# Altium schematic sheet MCISO-S05-V00-CANIsolation.SchDoc: Isolated CANBUS @ 3V3
size A3; DrawnBy: Jonn Dillon; DocumentNumber: 4; Revision: 01; SheetNumber: 3; SheetTotal: 9; Version: 01; Project: Battery Managment System 2020; PageSetup: Record=PageOptions|CenterHorizontal=True|CenterVertical=True|PrintScale=0.97|XCorrection=1.00|YCorrection=1.00|PrintKind=0|BorderSize=5000000|LeftOffset=0|BottomOffset=0|Orientation=2|PaperLength=1000|PaperWidth=1000|Scale=100|PaperSource=7|PrintQuality=-4|MediaType=1|DitherType=10|PaperKind=A4|PrintScaleMode=1
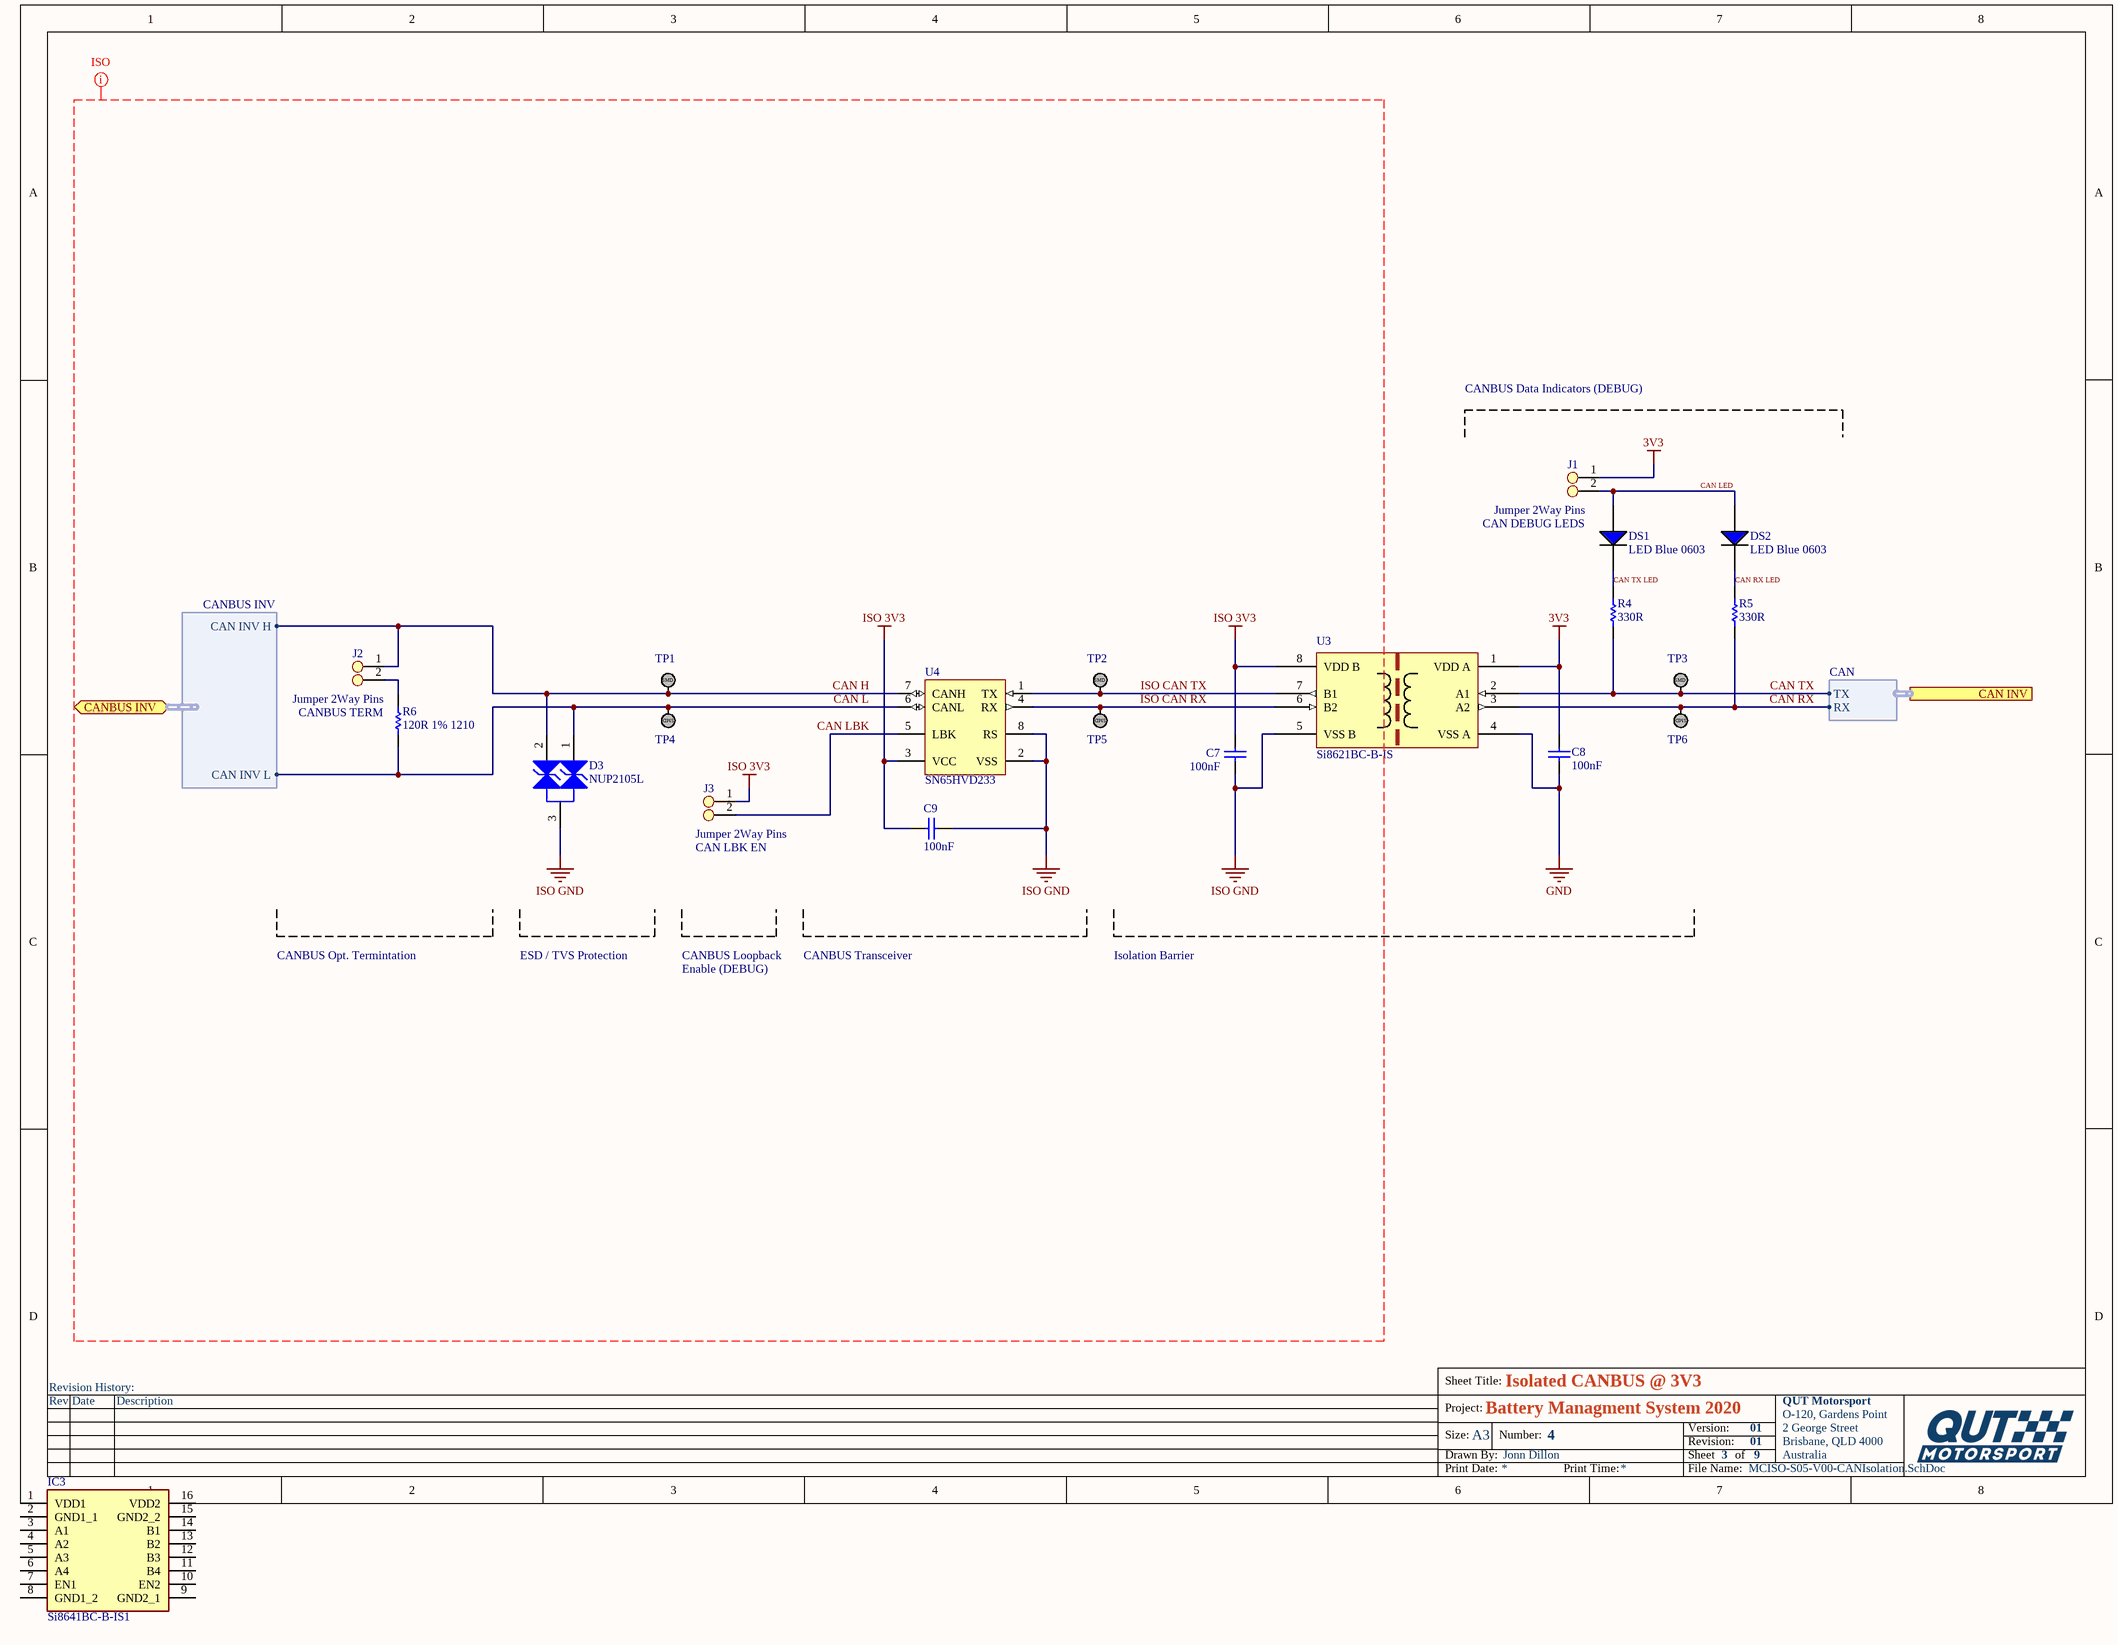
[diagram p0: MCISO-S05-V00-CANIsolation.SchDoc]

## Parts
C7  100nF  [Cap_Ceramic_0603]
C8  100nF  [Cap_Ceramic_0603]
C9  100nF  [Cap_Ceramic_0603]
D3  NUP2105L  [NUP2105L]
DS1  LED Blue 0603  [LED BLUE 0603]
DS2  LED Blue 0603  [LED BLUE 0603]
IC3  Si8641BC-B-IS1  [SOIC127P600X175-16N]
J1  Jumper 2Way Pins  [Jumper_2Way_Pin]
J2  Jumper 2Way Pins  [Jumper_2Way_Pin]
J3  Jumper 2Way Pins  [Jumper_2Way_Pin]
R4  330R  [Res_ThinFilm_0603]
R5  330R  [Res_ThinFilm_0603]
R6  120R 1% 1210  [Res_ThinFilm_1210]
TP1  TestPoint_SMD  [TestPointSMD]  (value not drawn)
TP2  TestPoint_SMD  [TestPointSMD]  (value not drawn)
TP3  TestPoint_SMD  [TestPointSMD]  (value not drawn)
TP4  TestPoint_SMD  [TestPointSMD]  (value not drawn)
TP5  TestPoint_SMD  [TestPointSMD]  (value not drawn)
TP6  TestPoint_SMD  [TestPointSMD]  (value not drawn)
U3  Si8621BC-B-IS  [Si8621BC-B-IS]
U4  SN65HVD233  [SN65HVD233DR]

## Ports
CAN INV (harness CAN), CANBUS INV (bidir, harness CANBUS INV)

## Harnesses
CANBUS INV: CAN INV H, CAN INV L
CAN: RX, TX

## Nets
3V3: C8.2 J1.1 U3.1(VDD_A)
GND: C8.1 U3.4(VSS_A)
ISO 3V3: C7.2 C9.2 J3.1 U3.8(VDD_B) U4.3(VCC)
ISO GND: C7.1 C9.1 D3.3 U3.5(VSS_B) U4.2(VSS) U4.8(RS)
CAN H: D3.2 J2.1 TP1.1 U4.7(CANH) ; port CANBUS INV.CAN INV H
CAN L: D3.1 R6.1 TP4.1 U4.6(CANL) ; port CANBUS INV.CAN INV L
CAN LBK: J3.2 U4.5(LBK)
CAN LED: DS1.1(A) DS2.1(A) J1.2
CAN RX: R5.1 TP6.1 U3.3(A2) ; port CAN INV.RX
CAN RX LED: DS2.2(C) R5.2
CAN TX: R4.1 TP3.1 U3.2(A1) ; port CAN INV.TX
CAN TX LED: DS1.2(C) R4.2
ISO CAN RX: TP5.1 U3.6(B2) U4.4(RX)
ISO CAN TX: TP2.1 U3.7(B1) U4.1(TX)
NetJ2_2: J2.2 R6.2

Not connected (* = marked no-connect by the designer): IC3 1(VDD1) 2(GND1_1) 3(A1) 4(A2) 5(A3) 6(A4) 7(EN1) 8(GND1_2) 9(GND2_1) 10(EN2) 11(B4) 12(B3) 13(B2) 14(B1) 15(GND2_2) 16(VDD2)

## Layout directives
mark named ISO: CAN H, CAN L, CAN LBK, ISO 3V3, ISO CAN RX, ISO CAN TX, ISO GND

## Notes on the sheet
- CANBUS Data Indicators (DEBUG)
- CAN DEBUG LEDS
- (near R6) CANBUS TERM
- (near J3) CAN LBK EN
- CANBUS Opt. Termintation
- ESD / TVS Protection
- CANBUS Loopback
- Enable (DEBUG)
- CANBUS Transceiver
- Isolation Barrier
- Revision History:
- Sheet Title:
- Rev
- Date
- Description
- Project:
- Size:
- Drawn By:
- A3
- Number:
- Revision:
- Sheet
- Version:
- of
- QUT Motorsport
- O-120, Gardens Point
- 2 George Street
- Brisbane, QLD 4000
- Australia
- Print Date:
- Print Time:
- File Name:
- (in symbol TestPoint_SMD) SMD

## Library data of the parts
C7-C9 = 100nF 50V 5% X7R 0603: Capacitor, Ceramic, SMD, 100nF, 50V, 5%, X7R, 0603
IC3 = Si8641BC-B-IS1: Integrated Circuit; Manufacturer_Name: Silicon Labs; Datasheet Link: https://componentsearchengine.com/Datasheets/2/SI8641BC-B-IS1.pdf; Height: 1.75mm; Manufacturer_Part_Number: Si8641BC-B-IS1; Mouser Part Number: 634-SI8641BC-B-IS1; Mouser Price/Stock: https://www.mouser.co.uk/ProductDetail/Silicon-Labs/SI8641BC-B-IS1?qs=j6MGy4L9yX1Vde%2FgWgVbaA%3D%3D; Arrow Part Number: SI8641BC-B-IS1; Arrow Price/Stock: https://www.arrow.com/en/products/si8641bc-b-is1/silicon-labs
J1-J3 = Jumper 2Way Side Pins
R4 R5 = 330R 5% 0603: Resistor, SMD, 330R, 0.1W, 5%, 0603
R6 = 120R 1% 1210: Resistor, SMD, 120R, 0.25W, 1%, 1210
D3 = NUP2105L: ComponentLink1Description: Datasheet; ComponentLink1URL: https://www.onsemi.cn/PowerSolutions/document/NUP2105L-D.PDF; Parameter 1: *; ComponentLink2Description: LCSC; ComponentLink2URL: https://lcsc.com/product-detail/TVS_ON-Semiconductor-NUP2105LT1G_C14486.html; ComponentLink3Description: Digikey; ComponentLink3URL: https://www.digikey.com.au/product-detail/en/on-semiconductor/SZNUP2105LT1G/SZNUP2105LT1GOSCT-ND/3487669
U3 = Si8621BC-B-IS: ComponentLink1Description: Digikey; ComponentLink1URL: https://www.digikey.com.au/product-detail/en/silicon-labs/SI8621BC-B-ISR/336-4774-1-ND/8611005; ComponentLink2Description: Datasheet; ComponentLink2URL: https://www.silabs.com/documents/public/data-sheets/si861x-2x-datasheet.pdf
U4 = SN65HVD233: ComponentLink1Description: LCSC; ComponentLink1URL: https://lcsc.com/product-detail/CAN-ICs_Texas-Instruments_SN65HVD233DRG4_Texas-Instruments-Texas-Instruments-SN65HVD233DRG4_C61643.html; ComponentLink2Description: Digikey; ComponentLink2URL: https://www.digikey.com.au/product-detail/en/texas-instruments/SN65HVD233DR/296-35967-1-ND/4134960; ComponentLink3Description: Datasheet; ComponentLink3URL: https://www.ti.com/lit/ds/symlink/sn65hvd233.pdf?ts=1588560888178; ComponentLink4Description: Ti Product Page; ComponentLink4URL: https://www.ti.com/product/SN65HVD233